# EAGLE schematic CoffeeHeater (EAGLE 9.2.0)
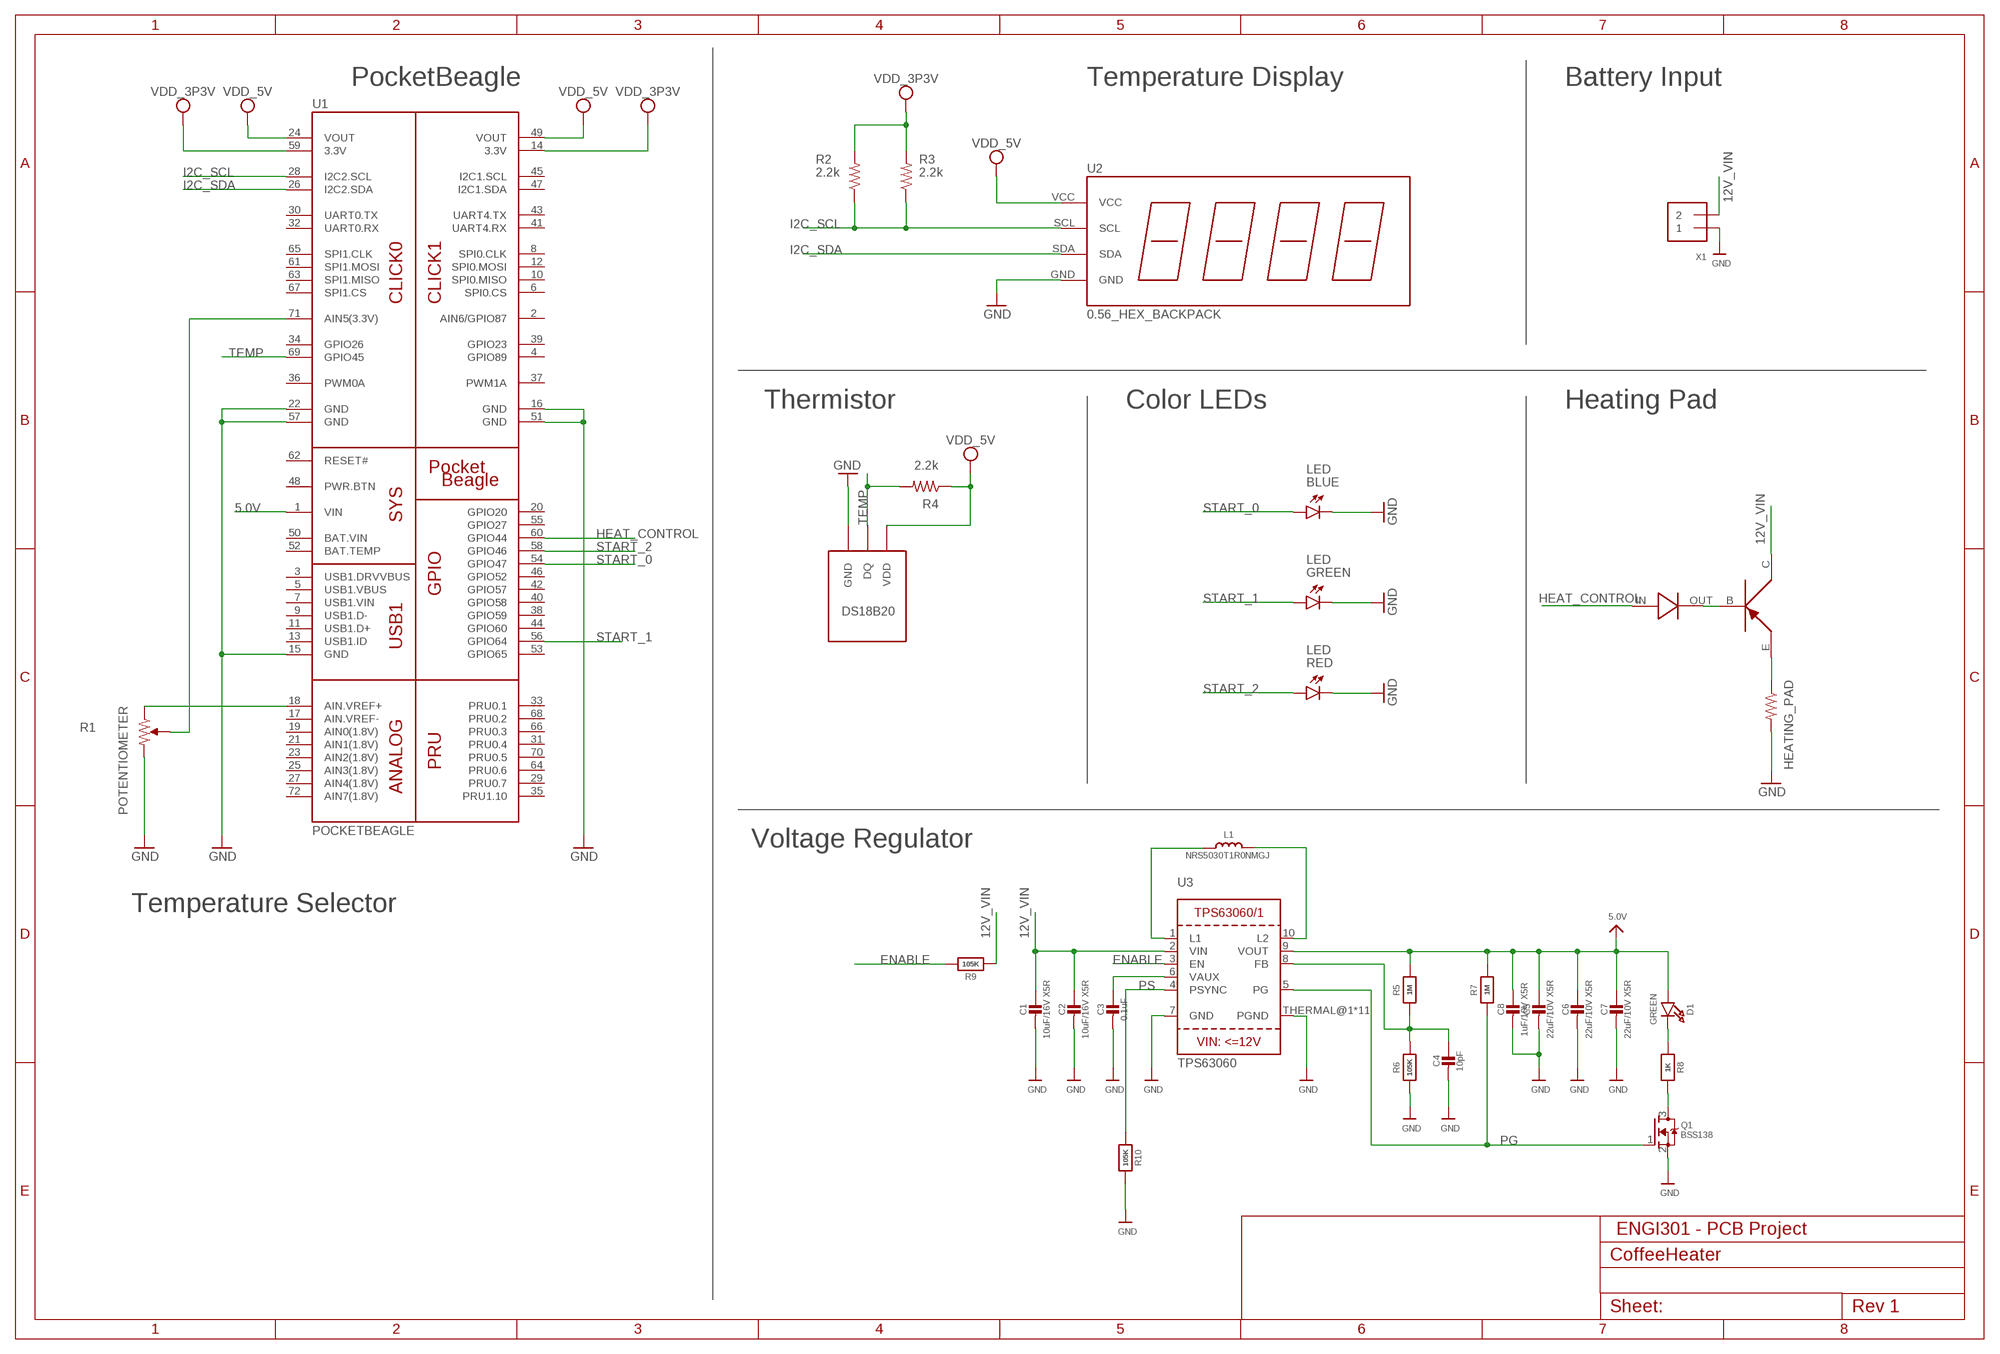
[diagram p0: schematic, sheet 1]

## Parts
BLUE  LED  [EIA-STD]
C1  10uF/16V X5R  CAP_CERAMIC0805-NOOUTLINE  [0805-NO]
C2  10uF/16V X5R  CAP_CERAMIC0805-NOOUTLINE  [0805-NO]
C3  0.1uF  CAP_CERAMIC0805-NOOUTLINE  [0805-NO]
C4  10pF  CAP_CERAMIC0805-NOOUTLINE  [0805-NO]
C5  22uF/10V X5R  CAP_CERAMIC0805-NOOUTLINE  [0805-NO]
C6  22uF/10V X5R  CAP_CERAMIC0805-NOOUTLINE  [0805-NO]
C7  22uF/10V X5R  CAP_CERAMIC0805-NOOUTLINE  [0805-NO]
C8  1uF/10V X5R  CAP_CERAMIC0805-NOOUTLINE  [0805-NO]
D1  GREEN  LED0805_NOOUTLINE  [CHIPLED_0805_NOOUTLINE]
GREEN  LED  [EIA-STD]
L1  NRS5030T1R0NMGJ  INDUCTORTDK_VLC5045  [INDUCTOR_5X5MM_TDK_VLC5045]
Q1  BSS138  MOSFET-NWIDE  [SOT23-WIDE]
R1  POTENTIOMETER  [POT-PO90S]
R2  2.2k  R_R0603  [R0603]
R3  2.2k  R_R0603  [R0603]
R4  2.2k  R_R0603  [R0603]
R5  1M  RESISTOR0805_NOOUTLINE  [0805-NO]
R6  105K  RESISTOR0805_NOOUTLINE  [0805-NO]
R7  1M  RESISTOR0805_NOOUTLINE  [0805-NO]
R8  1K  RESISTOR0805_NOOUTLINE  [0805-NO]
R9  105K  RESISTOR0805_NOOUTLINE  [0805-NO]
R10  105K  RESISTOR0805_NOOUTLINE  [0805-NO]
RED  LED  [EIA-STD]
U1  POCKETBEAGLE  [POCKETBEAGLE]
U2  0.56_HEX_BACKPACK  [0.56_HEX_BACKPACK]
U3  TPS63060  VREG_TPS63060/1  [PWSON-N10]
U$1  DS18B20_TEMP_SENSOR  [DS18B20_TEMP_SENSOR]
U$2  TIP32C_TRANSISTOR  [TIP32C_TRANSISTOR]
U$3  DIODE  [DIODE]
U$4  HEATING_PAD  [HEATING_PAD]
X1  TERMBLOCK_1X2  [TERMBLOCK_1X2-3.5MM]

## Nets
5.0V: C5.1 C6.1 C7.1 C8.1 D1.A R5.2 R7.2 U1.1(VIN) U3.9(VOUT)
12V_VIN: C1.1 C2.1 R9.1 U3.2(VIN) U$2.C X1.2
BASE: U$2.B U$3.OUT
ENABLE: R9.2 U3.3(EN)
GND: BLUE.P$2(C) C1.2 C2.2 C3.2 C4.2 C5.2 C6.2 C7.2 C8.2 GREEN.P$2(C) Q1.2(S) R1.CW R6.1 R10.2 RED.P$2(C) U1.15(GND) U1.16(GND) U1.22(GND) U1.51(GND) U1.57(GND) U2.GND U3.7(GND) U3.THERMAL@1(PGND) U3.THERMAL@5(PGND) U3.THERMAL@6(PGND) U3.THERMAL@7(PGND) U3.THERMAL@8(PGND) U3.THERMAL@9(PGND) U3.THERMAL@10(PGND) U3.THERMAL@11(PGND) U3.THERMAL@12(PGND) U3.THERMAL@13(PGND) U3.THERMAL@14(PGND) U$1.GND U$4.GND X1.1
HEAT_CONTROL: U1.60(GPIO44) U$3.IN
I2C_SCL: R2.1 R3.1 U1.28(I2C2.SCL) U2.SCL
I2C_SDA: U1.26(I2C2.SDA) U2.SDA
N$1: U$2.E U$4.VDD
N$2: R1.CCW U1.18(AIN.VREF+)
N$3: R1.S U1.71(AIN5(3.3V))
N$6: L1.P$1 U3.1(L1)
N$7: L1.P$2 U3.10(L2)
N$8: C3.1 U3.6(VAUX)
N$9: C4.1 R5.1 R6.2 U3.8(FB)
N$10: D1.C R8.1
N$11: Q1.3(D) R8.2
PG: Q1.1(G) R7.1 U3.5(PG)
PS: R10.1 U3.4(PSYNC)
START_0: BLUE.P$1(A) U1.54(GPIO47)
START_1: GREEN.P$1(A) U1.56(GPIO64)
START_2: RED.P$1(A) U1.58(GPIO46)
TEMP: R4.2 U1.69(GPIO45) U$1.DQ
VDD_3P3V: R2.2 R3.2 U1.14(3.3V) U1.59(3.3V)
VDD_5V: R4.1 U1.24(VOUT) U1.49(VOUT) U2.VCC U$1.VDD
Unconnected: U1.2(AIN6/GPIO87) U1.3(USB1.DRVVBUS) U1.4(GPIO89) U1.5(USB1.VBUS) U1.6(SPI0.CS) U1.7(USB1.VIN) U1.8(SPI0.CLK) U1.9(USB1.D-) U1.10(SPI0.MISO) U1.11(USB1.D+) U1.12(SPI0.MOSI) U1.13(USB1.ID) U1.17(AIN.VREF-) U1.19(AIN0(1.8V)) U1.20(GPIO20) U1.21(AIN1(1.8V)) U1.23(AIN2(1.8V)) U1.25(AIN3(1.8V)) U1.27(AIN4(1.8V)) U1.29(PRU0.7) U1.30(UART0.TX) U1.31(PRU0.4) U1.32(UART0.RX) U1.33(PRU0.1) U1.34(GPIO26) U1.35(PRU1.10) U1.36(PWM0A) U1.37(PWM1A) U1.38(GPIO59) U1.39(GPIO23) U1.40(GPIO58) U1.41(UART4.RX) U1.42(GPIO57) U1.43(UART4.TX) U1.44(GPIO60) U1.45(I2C1.SCL) U1.46(GPIO52) U1.47(I2C1.SDA) U1.48(PWR.BTN) U1.52(BAT.TEMP) U1.53(GPIO65) U1.55(GPIO27) U1.61(SPI1.MOSI) U1.62(RESET#) U1.63(SPI1.MISO) U1.64(PRU0.6) U1.65(SPI1.CLK) U1.66(PRU0.3) U1.67(SPI1.CS) U1.68(PRU0.2) U1.70(PRU0.5) U1.72(AIN7(1.8V))

## Notes on the sheet
- PocketBeagle | Temperature Display | Battery Input
- Thermistor | Color LEDs | Heating Pad
- Voltage Regulator
- Temperature Selector
- ENGI301 - PCB Project

## Power pins joined to a net without a drawn wire
BAT.VIN: U1.50(BAT.VIN)

## Library data of the parts
BLUE GREEN RED = ENGI301:LED: LTST-C191TBKT Series of LEDs
C1-C8 = microbuilder:CAP_CERAMIC: Ceramic Capacitors For new designs, use the packages preceded by an '_' character since they are more reliable: The following footprints should be used on most boards: _0402 - Standard footprint for regular board layouts _0603 - Standard footprint for regular board layouts _0805 - Standard footprint for regular board layouts _1206 - Standard footprint for regular board layouts For extremely tight-pitch boards where space is at a premium, the following 'micro-pitch' footprints can be used (smaller pads, no silkscreen outline, etc.): _0402MP - Micro-pitch footprint for very dense/compact boards _0603MP - Micro-pitch footprint for very dense/compact boards _0805MP - Micro-pitch footprint for very dense/compact boards _1206MP - Micro-pitch footprint for very dense/compact boards
D1 = microbuilder:LED: LED 0603 - 0603 Surface Mount Package 2mA: Green LED - Low Power (3.9mcd, 2ma, 1.7Vf) - Digikey: 475-2709-2-ND Orange LED - Low Power (9.8mcd, 2ma, 1.8Vf) - Digikey: 475-1194-2-ND Red LED - Low Power (5mcd, 2ma, 1.8Vf) - Digikey: 475-1195-2-ND Yellow LED - Low Power (7mcd, 2ma, 1.8Vf) - Digikey: 475-1196-2-ND 5mA: Blue LED - Low Power (17mcd, 5ma, 2.9Vf) - Digikey: LNJ937W8CRACT-ND 0805 - 0805 Surface Mount Package 2mA: Red LED (8.8mcd, 2mA, 1.8Vf, Clear) - Low Power [Digikey: 475-2510-1-ND] Green LED (5mcd, 2mA, 1.8Vf, Clear) - Low Power [Digikey: 475-2730-1-ND] Yellow LED (11.3mcd, 2mA, 1.8Vf, Clear) - Low Power [Digikey: 475-2555-1-ND] 20mA: Red LED (104mcd, 20mA, Diffused) - LS R976 [Digikey: 475-1278-6-ND] Red LED (12mcd, 20mA, 2.0Vf, Clear) - APT2012EC [Digikey: 754-1128-1-ND] Green LED (15mcd, 20mA, 2.2Vf, Clear) - APT2012GC [Digikey: 754-1131-1-ND] Orange LED (160mcd, 20mA, 2.1Vf, Clear) - APT2012SECK [Digikey: 754-1130-1-ND] 1206 - 1206 Surface Mount Package Green LED (26mcd, 20mA, Diffused) - LG N971 [Digikey: 475-1407-6-ND] Red LED (15mcd, 20mA, Diffused) - LH N974 [Digikey: 475-1416-6-ND] Cree - Cree High-Power Surface Mount LEDs XPEBWT-L1-0000-00D50 - White 111lm 350mA 2.9Vf 6200K 110° XTEAWT-00-0000-00000LEE3 - White 114lm 350mA 2.85Vf 5000K 115° Everlight - Everlight 45-21 Series Surface Mount LEDs 45-21/QK2C-B2832AC2CB2/2T - Warm White 2000mcd 20mA 3.25Vf 3050K 120° 45-21/LK2C-B38452C4CB2/2T - Nuetral White 2000mcd 20mA 3.25Vf 4150K 120° 45-21/LK2C-B50634C6CB2/2T - Cold White 2200mcd 20mA 3.25Vf 5650K 120° PLCC2 Reverse Mount LS T77K-J1L2-1-0-2-R18-Z - Red 11.25mcd 2mA 1.8Vf 630nm 120° LO T77K-L1M2-24-Z - Orange 19.6mcd 2mA 1.8Vf 606nm 120° LY T77K-K2M1-26-Z - Yellow 15.7mcd 2mA 1.8Vf 587nm 120°
L1 = microbuilder:INDUCTOR: Inductors 0603: 10nH Ceramic Inductor - microwire antenna/RF (Digikey: 712-1434-2-ND) 0805: 560nH Ceramic Inductor - RF (Digikey: 553-1047-1-ND) 270nH Ceramic Inductor - Q = 40@250MHz, +-5%, 1 Ohm DC Resistance (Digikey: 535-10506-2-ND) 1007 (2518 Metric) SMT: 10µH 10% 250mOhm 820mA 1007 Inductor (Digikey: 587-2189-1-ND) 22µH 10% 500mOhm 580mA 1007 Inductor (Digikey: 587-2190-1-ND) 47µH 10% 950mOhm 420mA 1007 Inductor (Digikey: 587-2191-1-ND) 47µH 5% 100mOhm 1A 1008 Inductor (Digikey: 732-1816-1-ND) 5.0x5.0mm (Taiyo Yuden NR5040 Series) 6.8µH 20% 2.3A 64mOhm Inductor (Digikey: 587-2374-2-ND) 5.0x5.0mm (TDK VLC5045 Series) 4.7µH 20% 3.3A 34mOhm Inductor (Digikey: 445-6526-1-ND) 6.8µH 20% 2.7A 46mOhm Inductor (Digikey: 445-6527-1-ND) 6.0x6.0mm (TDK VLC6045 Series) 4.7µH 20% 3.8A 27mOhm Inductor (Digikey: 445-6538-2-ND) 6.8µH 20% 3A 41mOhm Inductor (Digikey: 445-6540-1-ND) 6.2µH 30% 2.2A 45mOhm Inductor (Digikey: SRR5028-6R2YCT-ND) - Not TDK VLC6045 but footprint should match 6.0x6.0mm (TDK SLF6045 Series) 6.8uH 30% 2A 33mOhm Inductor (Digikey: 445-4572-1-ND, Mouser: 810-SLF645T6R8N2R0PF) 6.0x6.0mm (Sumida CDRH5D28 Series) 6.2uH 30% 1.8A 45mOhm Inductor (Digikey: 308-1542-1-ND) Taiyo Yuden NR3015T2R2M - 2.2uH 20% 1.5A (Digikey: 587-1648-2-ND, Mouser: 963-NR3015T2R2M) - Used with TI TPS62172 CoilCraft RFID Transponder Coil - MA5532-AE (For use with AS3935 Lightning Sensor) Vishay IHLP 1.0uH Molded Inductor - 24mOhm DCR, 5A, +/-20%, -55°C-125°C (Digikey: 541-1319-1-ND)
Q1 = microbuilder:MOSFET-N: N-Channel Mosfet LEGEND VDS: Voltage Drain-Source ID: Drain Current RDS(ON): Drain-Source On-State Resistance VGS(TH): Gate-Source Threshold Voltage CISS: Drain-Source Input Capacitance SOT-23 Name VDS ID RDS(ON) VGS(TH) CISS Order Number 2N7002E 60V 260mA 2.5 Ohm 2.5V @ 250uA 26.7pF @ 25V 2N7002ET1GOSTR-ND BSH103 30V 850mA 400 mOhm 400mV @ 1mA 83pF @ 24V BSH103,235-ND BSS138 60V 320mA 1.6 Ohm 1.5V @ 250uA 50pF @ 10V Mouser: 771-BSS138PW115 DMN2075U-7 20V 4.2A 38 mOhm 1V @ 250 uA 594.3pF @ 10V DMN2075U-7DICT-ND * BSS138 good choice for I2C level-shifting POWERPAK 1212-8 Name VDS ID RDS(ON) VGS(TH) CISS Order Number Si7308DN 60V 6A 58 mOhm 3V @ 250uA 665pF @ 15V SI7308DN-T1-E3CT-ND
R1 = ENGI301:POTENTIOMETER: Potentiometer - Examples: P090S-14T20BR10K (987-1277-ND)
R2-R4 = ENGI301:R_: RESISTOR, American symbol
R5-R10 = microbuilder:RESISTOR: Resistors For new designs, use the packages preceded by an '_' character since they are more reliable: The following footprints should be used on most boards: _0402 - Standard footprint for regular board layouts _0603 - Standard footprint for regular board layouts _0805 - Standard footprint for regular board layouts _1206 - Standard footprint for regular board layouts For extremely tight-pitch boards where space is at a premium, the following 'micro-pitch' footprints can be used (smaller pads, no silkscreen outline, etc.): _0402MP - Micro-pitch footprint for very dense/compact boards _0603MP - Micro-pitch footprint for very dense/compact boards _0805MP - Micro-pitch footprint for very dense/compact boards _1206MP - Micro-pitch footprint for very dense/compact boards
U1 = ENGI301:POCKETBEAGLE
U2 = ENGI301:0.56_HEX_BACKPACK: 0.56" LED HEX Backback - Adafruit HT16K33 - https://www.adafruit.com/product/878 - https://www.adafruit.com/product/879 - https://www.adafruit.com/product/880 - https://www.adafruit.com/product/881 - https://www.adafruit.com/product/1002
U3 = microbuilder:VREG_TPS63060/1: TPS63060/63061 2A Boost/Buck Switch Converter VIN: 2.5 - 12V Fixed frequency operation: 2.4MHz
U$1 = CoffeeHeater:DS18B20_TEMP_SENSOR
U$2 = CoffeeHeater:TIP32C_TRANSISTOR
U$3 = CoffeeHeater:DIODE
U$4 = CoffeeHeater:HEATING_PAD
X1 = microbuilder:TERMBLOCK_1X2: 3.5mm Terminal block http://www.ladyada.net/library/pcb/eaglelibrary.html